# EAGLE schematic Jumper_1.1 (EAGLE 7.6.0)
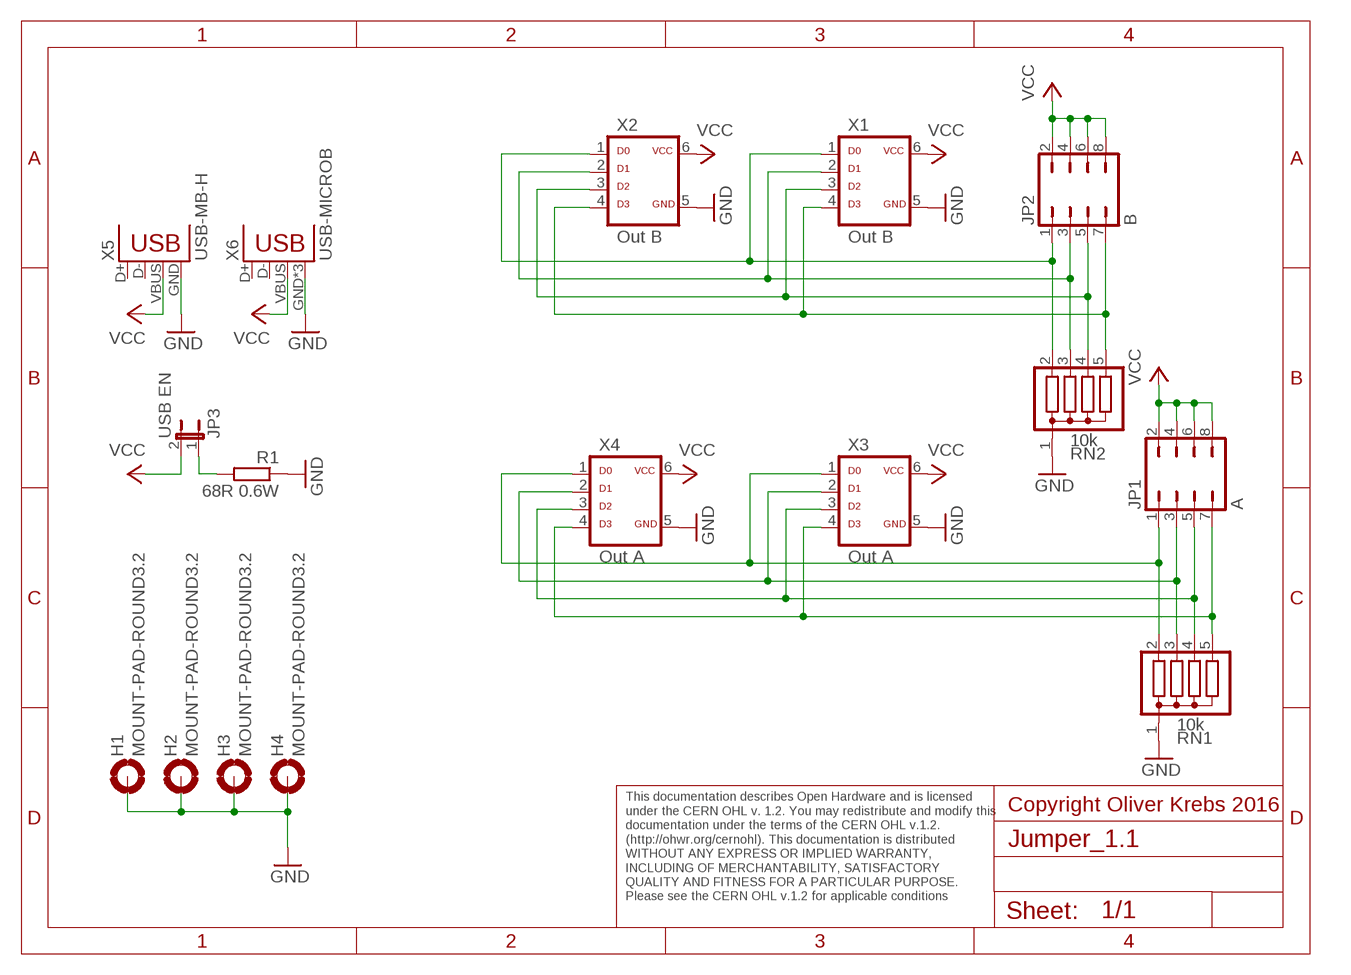
[diagram p0: schematic, sheet 1]

## Parts
H1  MOUNT-PAD-ROUND3.2  [3,2-PAD]
H2  MOUNT-PAD-ROUND3.2  [3,2-PAD]
H3  MOUNT-PAD-ROUND3.2  [3,2-PAD]
H4  MOUNT-PAD-ROUND3.2  [3,2-PAD]
JP1  A  JP4Q  [JP4Q]
JP2  B  JP4Q  [JP4Q]
JP3  USB EN  JP1E  [JP1]
R1  68R 0.6W  R-EU_0207/10  [0207/10]
RN1  10k  G04R  [SIL5]
RN2  10k  G04R  [SIL5]
X1  Out B  ML6D  [ML-6]
X2  Out B  ML6D  [ML-6]
X3  Out A  ML6D  [ML-6]
X4  Out A  ML6D  [ML-6]
X5  USB-MB-H  [USB-MB-H]
X6  USB-MICROB  [USB-MICROB]

## Nets
GND: H1.B3,2(MOUNT) H2.B3,2(MOUNT) H3.B3,2(MOUNT) H4.B3,2(MOUNT) R1.1 RN1.1 RN2.1 X1.5 X2.5 X3.5 X4.5 X5.GND X6.GND X6.MT1(GND) X6.MT2(GND)
N$1: JP2.1 RN2.2 X1.1 X2.1
N$2: JP2.3 RN2.3 X1.2 X2.2
N$3: JP1.1 RN1.2 X3.1 X4.1
N$4: JP2.7 RN2.5 X1.4 X2.4
N$5: JP1.3 RN1.3 X3.2 X4.2
N$6: JP1.7 RN1.5 X3.4 X4.4
N$7: JP2.5 RN2.4 X1.3 X2.3
N$8: JP1.5 RN1.4 X3.3 X4.3
N$10: JP3.1 R1.2
VCC: JP1.2 JP1.4 JP1.6 JP1.8 JP2.2 JP2.4 JP2.6 JP2.8 JP3.2 X1.6 X2.6 X3.6 X4.6 X5.VBUS X6.VBUS
Unconnected: X5.D+ X5.D- X6.D+ X6.D-

## Notes on the sheet
- Copyright Oliver Krebs 2016
- This documentation describes Open Hardware and is licensed 
  under the CERN OHL v. 1.2. You may redistribute and modify this 
  documentation under the terms of the CERN OHL v.1.2. 
  (http://ohwr.org/cernohl). This documentation is distributed
  WITHOUT ANY EXPRESS OR IMPLIED WARRANTY, 
  INCLUDING OF MERCHANTABILITY, SATISFACTORY 
  QUALITY AND FITNESS FOR A PARTICULAR PURPOSE. 
  Please see the CERN OHL v.1.2 for applicable conditions

## Library data of the parts
H1-H4 = holes:MOUNT-PAD-ROUND: MOUNTING PAD, round
JP1 JP2 = 01-my-con:JP4Q
JP3 = jumper:JP1E: JUMPER
R1 = 01-my_rcl:R-EU_: RESISTOR, European symbol
RN1 RN2 = resistor-sil:G04R: SIL RESISTOR; OC_FARNELL: unknown; OC_NEWARK: unknown
X1-X4 = 01-my-con:ML6D
X5 = SparkFun-Connectors:USB: USB Connectors USB-B-PTH is fully proven SKU : PRT-00139/CONN-08278 USB-miniB is fully proven SKU : PRT-00587 USB-A-PCB is untested. USB-A-H is throughly reviewed, but untested. Spark Fun Electronics SKU : PRT-00437 USB-B-SMT is throughly reviewed, but untested. Needs silkscreen touching up. USB-A-S has not been used/tested USB-MB-H has not been used/tested USB-MICROB has been used. CONN-09505
X6 = SparkFun-Connectors:USB: USB Connectors USB-B-PTH is fully proven SKU : PRT-00139/CONN-08278 USB-miniB is fully proven SKU : PRT-00587 USB-A-PCB is untested. USB-A-H is throughly reviewed, but untested. Spark Fun Electronics SKU : PRT-00437 USB-B-SMT is throughly reviewed, but untested. Needs silkscreen touching up. USB-A-S has not been used/tested USB-MB-H has not been used/tested USB-MICROB has been used. CONN-09505; PROD_ID: CONN-09505